# EAGLE schematic RFModule900 (EAGLE 7.2.0)
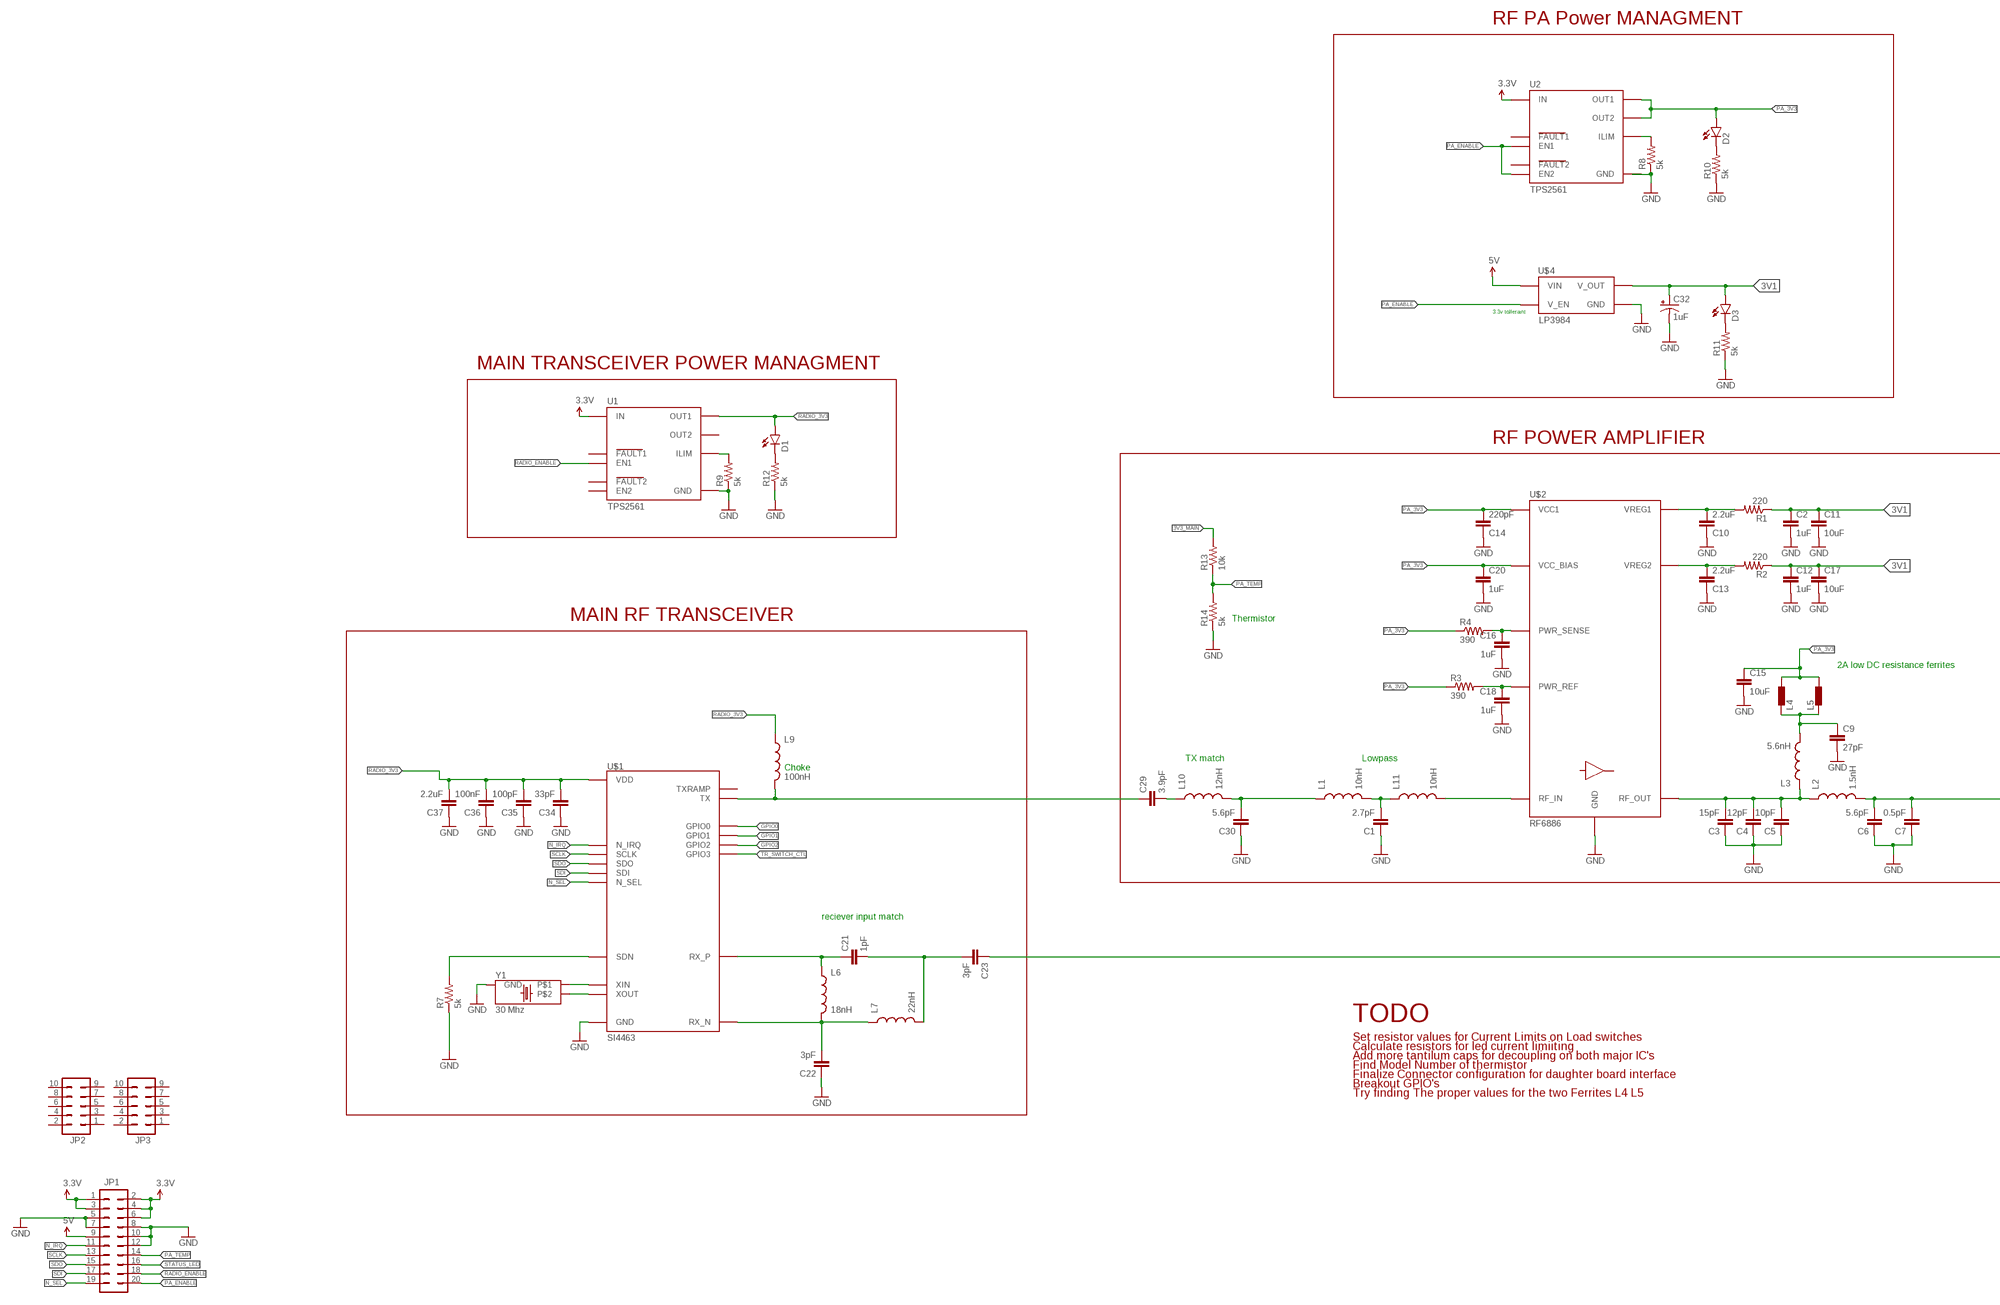
[diagram p0: schematic, sheet 1, part 1 of 2]
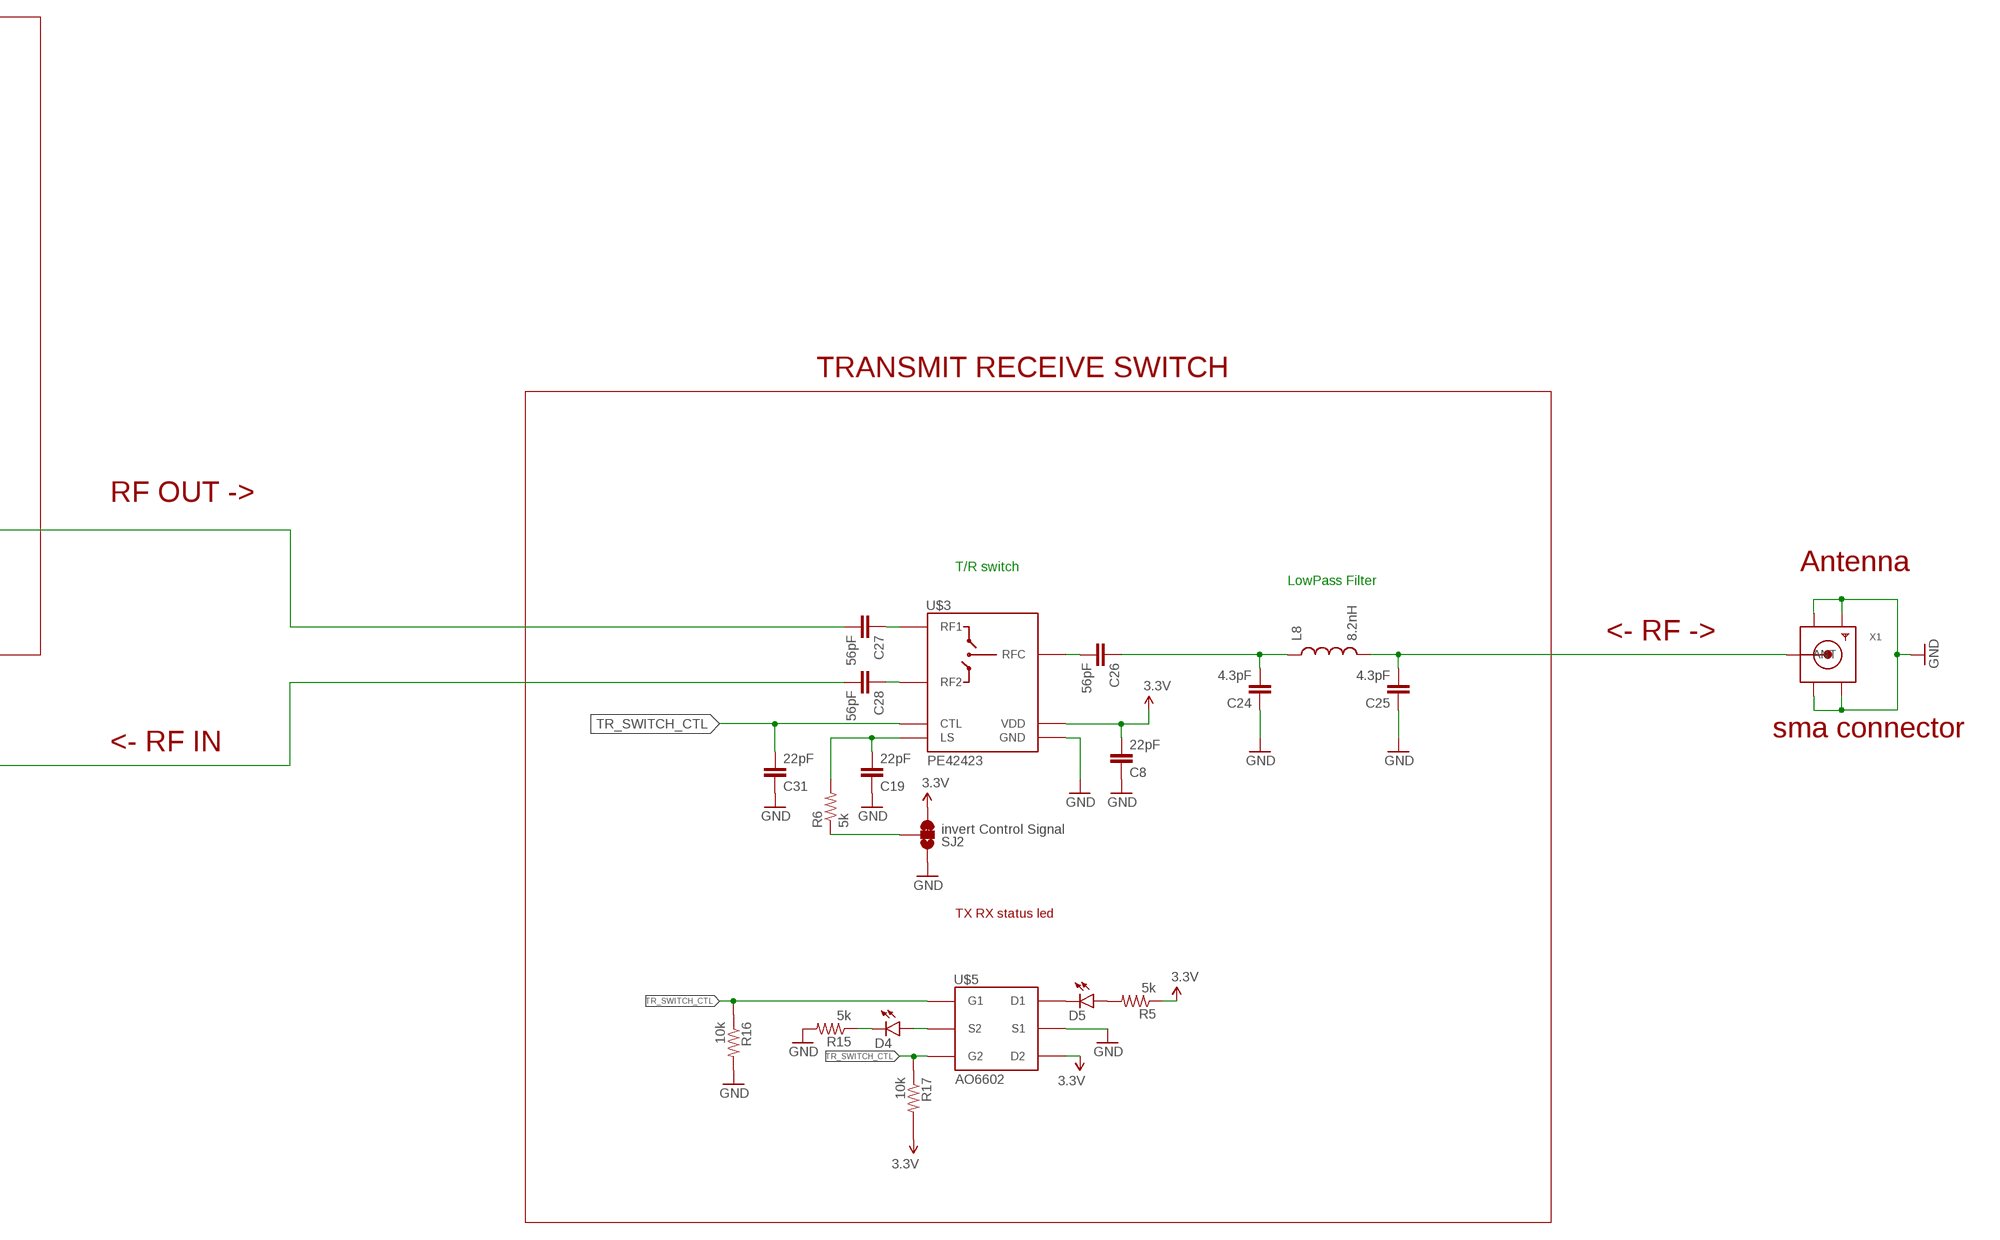
[diagram p1: schematic, sheet 1, part 2 of 2]

## Parts
C1  2.7pF  CAP0402-CAP  [0402-CAP]
C2  1uF  CAP0402-CAP  [0402-CAP]
C3  15pF  CAP0402-CAP  [0402-CAP]
C4  12pF  CAP0402-CAP  [0402-CAP]
C5  10pF  CAP0402-CAP  [0402-CAP]
C6  5.6pF  CAP0402-CAP  [0402-CAP]
C7  0.5pF  CAP0402-CAP  [0402-CAP]
C8  22pF  CAP0402-CAP  [0402-CAP]
C9  27pF  CAP0402-CAP  [0402-CAP]
C10  2.2uF  CAP0402-CAP  [0402-CAP]
C11  10uF  CAP0402-CAP  [0402-CAP]
C12  1uF  CAP0402-CAP  [0402-CAP]
C13  2.2uF  CAP0402-CAP  [0402-CAP]
C14  220pF  CAP0402-CAP  [0402-CAP]
C15  10uF  CAP0402-CAP  [0402-CAP]
C16  1uF  CAP0402-CAP  [0402-CAP]
C17  10uF  CAP0402-CAP  [0402-CAP]
C18  1uF  CAP0402-CAP  [0402-CAP]
C19  22pF  CAP0402-CAP  [0402-CAP]
C20  1uF  CAP0402-CAP  [0402-CAP]
C21  1pF  CAP0402-CAP  [0402-CAP]
C22  3pF  CAP0402-CAP  [0402-CAP]
C23  3pF  CAP0402-CAP  [0402-CAP]
C24  4.3pF  CAP0402-CAP  [0402-CAP]
C25  4.3pF  CAP0402-CAP  [0402-CAP]
C26  56pF  CAP0402-CAP  [0402-CAP]
C27  56pF  CAP0402-CAP  [0402-CAP]
C28  56pF  CAP0402-CAP  [0402-CAP]
C29  3.9pF  CAP0402-CAP  [0402-CAP]
C30  5.6pF  CAP0402-CAP  [0402-CAP]
C31  22pF  CAP0402-CAP  [0402-CAP]
C32  1uF  10UF-16V-10%(TANT)  [EIA3216]
C34  33pF  CAP0402-CAP  [0402-CAP]
C35  100pF  CAP0402-CAP  [0402-CAP]
C36  100nF  CAP0402-CAP  [0402-CAP]
C37  2.2uF  CAP0402-CAP  [0402-CAP]
D1  LED0603  [LED-0603]
D2  LED0603  [LED-0603]
D3  LED0603  [LED-0603]
D4  LED0603  [LED-0603]
D5  LED0603  [LED-0603]
JP1  M10X2SPECIAL  [2X10_LOCK_SPECIAL]
JP2  M05X2PTH  [AVR_ICSP]
JP3  M05X2PTH  [AVR_ICSP]
L1  10nH  INDUCTOR0402  [C0402]
L2  1.5nH  INDUCTOR0402  [C0402]
L3  5.6nH  INDUCTOR0402  [C0402]
L4  BLM15HB121SN1  [0402]
L5  BLM15HB121SN1  [0402]
L6  18nH  INDUCTOR0402  [C0402]
L7  22nH  INDUCTOR0402  [C0402]
L8  8.2nH  INDUCTOR0402  [C0402]
L9  100nH  INDUCTOR0402  [C0402]
L10  12nH  INDUCTOR0402  [C0402]
L11  10nH  INDUCTOR0402  [C0402]
R1  220  RESISTOR0402  [0402-RES]
R2  220  RESISTOR0402  [0402-RES]
R3  390  RESISTOR0402  [0402-RES]
R4  390  RESISTOR0402  [0402-RES]
R5  5k  RESISTOR0402  [0402-RES]
R6  5k  RESISTOR0402  [0402-RES]
R7  5k  RESISTOR0402  [0402-RES]
R8  5k  RESISTOR0402  [0402-RES]
R9  5k  RESISTOR0402  [0402-RES]
R10  5k  RESISTOR0402  [0402-RES]
R11  5k  RESISTOR0402  [0402-RES]
R12  5k  RESISTOR0402  [0402-RES]
R13  10k  RESISTOR0402  [0402-RES]
R14  5k  RESISTOR0402  [0402-RES]
R15  5k  RESISTOR0402  [0402-RES]
R16  10k  RESISTOR0402  [0402-RES]
R17  10k  RESISTOR0402  [0402-RES]
SJ2  invert Control Signal  JUMPER-PAD-3-2OF3_NC_BY_TRACE_SMALL  [PAD-JUMPER-3-2OF3_NC_BY_TRACE_YES_SILK_FULL_BOX]
U1  TPS2561  [10-VFDFN]
U2  TPS2561  [10-VFDFN]
U$1  SI4463  [20-VFQFN]
U$2  RF6886  [24-VFQFN]
U$3  PE42423  [16-QFN]
U$4  LP3984  [SOT23-5]
U$5  AO6602  [TSOP-6]
X1  SMACONNECTOR  [SMA90_DIP]
Y1  30 Mhz  CRYSTAL  [4-SMD_3.2_X_2.5]

## Nets
3.3V: C8.2 JP1.1 JP1.2 JP1.3 JP1.4 JP1.6 R5.1 SJ2.3 U1.P$2(IN) U1.P$3(IN) U2.P$2(IN) U2.P$3(IN) U$3.P$16(VDD) U$5.4(D2)
3V1: C32.A(+) D3.A U$4.5(V_OUT)
3V3_MAIN: R13.2
5V: JP1.9 U$4.1(VIN)
GND: C1.1 C2.2 C3.1 C4.1 C5.1 C6.1 C7.1 C8.1 C9.2 C10.1 C11.2 C12.2 C13.1 C14.1 C15.2 C16.2 C17.2 C18.2 C19.1 C20.2 C22.1 C24.1 C25.1 C30.1 C31.1 C32.C(-) C34.1 C35.1 C36.1 C37.1 JP1.5 JP1.7 JP1.8 JP1.10 JP1.12 R7.1 R8.1 R9.1 R10.1 R11.1 R12.1 R14.1 R15.2 R16.2 SJ2.1 U1.GNDPAD(GND) U1.P$1(GND) U2.GNDPAD(GND) U2.P$1(GND) U$1.GND_PAD(GND) U$1.P$18(GND) U$2.P$GND_PAD(GND) U$3.P$1(GND) U$3.P$3(GND) U$3.P$4(GND) U$3.P$5(GND) U$3.P$6(GND) U$3.P$8(GND) U$3.P$9(GND) U$3.P$10(GND) U$3.P$12(GND) U$3.P$13(GND) U$3.P$GNDPAD(GND) U$4.2(GND) U$5.5(S1) X1.GND1 X1.GND2 X1.GND3 X1.GND4 Y1.P$2(GND) Y1.P$4(GND)
GPIO0: U$1.P$9(GPIO0)
GPIO1: U$1.P$10(GPIO1)
GPIO2: U$1.P$19(GPIO2)
N$1: C1.2 L1.2 L11.1
N$2: C10.2 R1.2 U$2.P$19(VREG1)
N$3: C12.1 C17.1 R2.1
N$4: C16.1 R4.2 U$2.P$23(PWR_SENSE)
N$5: C6.2 C7.2 C27.2 L2.2
N$6: C9.1 L3.2 L4.1 L5.1
N$7: D3.C R11.2
N$8: C3.2 C4.2 C5.2 L2.1 L3.1 U$2.P$13(RF_OUT) U$2.P$14(RF_OUT) U$2.P$15(RF_OUT) U$2.P$16(RF_OUT) U$2.P$17(RF_OUT) U$2.P$18(RF_OUT)
N$9: C13.2 R2.2 U$2.P$5(VREG2)
N$10: C24.2 C26.1 L8.1
N$11: R9.2 U1.P$7(ILIM)
N$12: C21.1 L6.1 U$1.P$2(RX_P)
N$13: C21.2 C23.2 L7.2
N$14: C23.1 C28.2
N$15: C25.2 L8.2 X1.ANTENNA(ANT)
N$16: C26.2 U$3.P$7(RFC)
N$17: L11.2 U$2.P$6(RF_IN)
N$18: C18.1 R3.2 U$2.P$24(PWR_REF)
N$19: C2.1 C11.1 R1.1
N$20: C29.1 L9.2 U$1.P$4(TX)
N$21: C29.2 L10.1
N$22: C30.2 L1.1 L10.2
N$23: C27.1 U$3.P$2(RF1)
N$24: C28.1 U$3.P$11(RF2)
N$25: R6.1 SJ2.2
N$26: C19.2 R6.2 U$3.P$15(LS)
N$27: C22.2 L6.2 L7.1 U$1.P$3(RX_N)
N$28: U$1.P$17(XIN) Y1.P$1
N$29: U$1.P$16(XOUT) Y1.P$3
N$30: D2.C R10.2
N$31: D1.C R12.2
N$32: R8.2 U2.P$7(ILIM)
N$33: D5.A R5.2
N$34: D5.C U$5.6(D1)
N$35: D4.A U$5.2(S2)
N$36: D4.C R15.1
N_IRQ: JP1.11 U$1.P$11(N_IRQ)
N_SEL: JP1.19 U$1.P$15(N_SEL)
PA_3V3: C14.2 C15.1 C20.1 D2.A L4.2 L5.2 R3.1 R4.1 U2.P$8(OUT2) U2.P$9(OUT1) U$2.P$1(VCC1) U$2.P$2(VCC1) U$2.P$3(VCC1) U$2.P$22(VCC_BIAS)
PA_ENABLE: JP1.20 U2.P$4(EN1) U2.P$5(EN2) U$4.3(V_EN)
PA_TEMP: JP1.14 R13.1 R14.2
RADIO_3V3: C34.2 C35.2 C36.2 C37.2 D1.A L9.1 U1.P$9(OUT1) U$1.P$6(VDD) U$1.P$8(VDD)
RADIO_ENABLE: JP1.18 R7.2 U1.P$4(EN1) U$1.P$1(SDN)
SCLK: JP1.13 U$1.P$12(SCLK)
SDI: JP1.17 U$1.P$14(SDI)
SDO: JP1.15 U$1.P$13(SDO)
STATUS_LED: JP1.16
TR_SWITCH_CTL: C31.2 U$1.P$20(GPIO3) U$3.P$14(CTL) U$5.1(G1) U$5.3(G2)
Unconnected: JP2.1 JP2.2 JP2.3 JP2.4 JP2.5 JP2.6 JP2.7 JP2.8 JP2.9 JP2.10 JP3.1 JP3.2 JP3.3 JP3.4 JP3.5 JP3.6 JP3.7 JP3.8 JP3.9 JP3.10 R16.1 R17.1 R17.2 U1.P$5(EN2) U1.P$6(FAULT2) U1.P$8(OUT2) U1.P$10(FAULT1) U2.P$6(FAULT2) U2.P$10(FAULT1) U$1.P$7(TXRAMP)

## Notes on the sheet
- RF PA Power MANAGMENT
- 3.3v tollerant
- MAIN TRANSCEIVER POWER MANAGMENT
- RF POWER AMPLIFIER
- MAIN RF TRANSCEIVER | Thermistor
- 2A low DC resistance ferrites
- TRANSMIT RECEIVE SWITCH
- TX match | Lowpass
- Choke
- RF OUT ->
- T/R switch | Antenna
- LowPass Filter
- <- RF ->
- reciever input match
- sma connector
- <- RF IN
- TODO
- Set resistor values for Current Limits on Load switches
- Calculate resistors for led current limiiting
- Add more tantilum caps for decoupling on both major IC's | TX RX status led
- Find Model Number of thermistor
- Finalize Connector configuration for daughter board interface
- Breakout GPIO's
- Try finding The proper values for the two Ferrites L4 L5

## Library data of the parts
C1-C31 C34-C37 = SparkFun-Capacitors:CAP: Capacitor Standard 0603 ceramic capacitor, and 0.1" leaded capacitor.
C32 = SparkFun-Capacitors:10UF-16V-10%(TANT): CAP-00811 1206/EIA-3216 Tantalum capacitor; DIGI: 399-3678-1-ND; MPN: T491A105K016AT; PROD_ID: CAP-00811; VALUE: 10uF
D1-D5 = SparkFun-LED:LED: LEDs Standard schematic elements and footprints for 5mm, 3mm, 1206, and 0603 sized LEDs. 5mm - Spark Fun Electronics SKU : COM-00529 (and others)
JP1 = SparkFun-Connectors:M10X2: This was SPECIALLY designed to be used with our Graphic LCD Backpack. Be sure you want to use this! It is not only staggered on each line of header holes, but IT IS ALSO offset of the center point of the top and bottom lines by 5 mil. This causes the headers to lock into place on the "standard" footprint on the LCD screen. The extra squares on the tdocu layer are there simply to reference other pins (if you were to actually populate a longer header than ten long - this is what we do with the backpacks).
JP2 JP3 = SparkFun-Connectors:M05X2: Header 5x2 Standard 10-pin dual row 0.1" header. Commonly used with AVR-ISP. Use with Spark Fun Electronics SKU: PRT-00778
L1 L2 L6-L11 = SparkFun-Passives:INDUCTOR: Inductors Basic Inductor/Choke - 0603 and 1206. Footprints are not proven and vary greatly between part numbers. INDUCTOR POWER 3.3UH 4.0A SMD 0.197" L x 0.197" W x 0.177" H (5.00mm x 5.00mm x 4.50mm)
L3 = SparkFun-Passives:INDUCTOR: Inductors Basic Inductor/Choke - 0603 and 1206. Footprints are not proven and vary greatly between part numbers. INDUCTOR POWER 3.3UH 4.0A SMD 0.197" L x 0.197" W x 0.177" H (5.00mm x 5.00mm x 4.50mm); COILCRAFT: 1606
L4 L5 = inductors:BLM15H: EMIFIL (R) Chip Ferrite Bead for GHz Noise Source: http://www.murata.com/ Ferrite Bead BLM15H.pdf
R1-R17 = SparkFun-Resistors:RESISTOR: Resistor Basic schematic elements and footprints for 0603, 1206, and PTH resistors.
SJ2 = SparkFun-Passives:JUMPER-PAD-3-2OF3_NC_BY_TRACE
U1 U2 = RitLaunchInitiative:TPS2561
U$1 = RitLaunchInitiative:SI4463
U$2 = RitLaunchInitiative:RF6886
U$3 = RitLaunchInitiative:PE42423
U$4 = RitLaunchInitiative:LP3984: LP3984IMF-3.1/NOPBCT-ND 3.1v ldo
U$5 = RitLaunchInitiative:AO6602: http://aosmd.com/res/data_sheets/AO6602.pdf; DIGI: 785-1077-1-ND; MPN: AO6602L
X1 = adafruit:SMACONNECTOR: SMA Connector 90° DIP SMA Connector, 50 Ohm (4UConnector: 07259)
Y1 = RitLaunchInitiative:CRYSTAL; DIGI: 887-1330-1-ND; MPN: 7M-30.000MEEQ-T